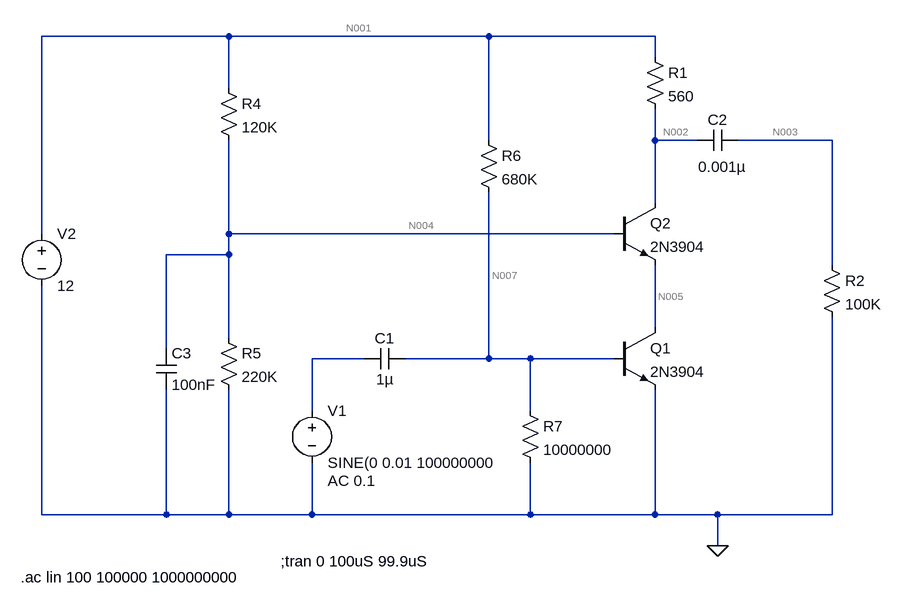
[diagram p0: schematic CascodeAmp2.asc]
CascodeAmp2.asc, the LTspice schematic file:
Version 4
SHEET 1 980 680
WIRE -416 -432 -704 -432
WIRE -16 -432 -416 -432
WIRE 240 -432 -16 -432
WIRE 240 -400 240 -432
WIRE -416 -352 -416 -432
WIRE -16 -272 -16 -432
WIRE 240 -272 240 -320
WIRE 304 -272 240 -272
WIRE 512 -272 368 -272
WIRE 240 -176 240 -272
WIRE -704 -128 -704 -432
WIRE -416 -128 -416 -272
WIRE 176 -128 -416 -128
WIRE -416 -96 -416 -128
WIRE -416 -96 -512 -96
WIRE 512 -80 512 -272
WIRE 240 16 240 -80
WIRE -416 32 -416 -96
WIRE -512 48 -512 -96
WIRE -208 64 -288 64
WIRE -16 64 -16 -192
WIRE -16 64 -144 64
WIRE 48 64 -16 64
WIRE 176 64 48 64
WIRE -288 144 -288 64
WIRE 48 144 48 64
WIRE -704 304 -704 -48
WIRE -512 304 -512 112
WIRE -512 304 -704 304
WIRE -416 304 -416 112
WIRE -416 304 -512 304
WIRE -288 304 -288 224
WIRE -288 304 -416 304
WIRE 48 304 48 224
WIRE 48 304 -288 304
WIRE 240 304 240 112
WIRE 240 304 48 304
WIRE 336 304 240 304
WIRE 512 304 512 0
WIRE 512 304 336 304
WIRE 336 352 336 304
FLAG 336 352 0
SYMBOL npn 176 16 R0
SYMATTR InstName Q1
SYMATTR Value 2N3904
SYMBOL cap -144 48 R90
WINDOW 0 0 32 VBottom 2
WINDOW 3 32 32 VTop 2
SYMATTR InstName C1
SYMATTR Value 1µ
SYMBOL res 224 -416 R0
SYMATTR InstName R1
SYMATTR Value 560
SYMBOL voltage -288 128 R0
WINDOW 123 24 124 Left 2
WINDOW 39 0 0 Left 0
SYMATTR Value2 AC 0.1
SYMATTR InstName V1
SYMATTR Value SINE(0 0.01 100000000
SYMBOL voltage -704 -144 R0
SYMATTR InstName V2
SYMATTR Value 12
SYMBOL cap 368 -288 R90
WINDOW 0 0 32 VBottom 2
WINDOW 3 41 25 VTop 2
SYMATTR InstName C2
SYMATTR Value 0.001µ
SYMBOL npn 176 -176 R0
SYMATTR InstName Q2
SYMATTR Value 2N3904
SYMBOL res -432 -368 R0
SYMATTR InstName R4
SYMATTR Value 120K
SYMBOL res -432 16 R0
SYMATTR InstName R5
SYMATTR Value 220K
SYMBOL res -32 -288 R0
SYMATTR InstName R6
SYMATTR Value 680K
SYMBOL res 32 128 R0
SYMATTR InstName R7
SYMATTR Value 10000000
SYMBOL cap -528 48 R0
SYMATTR InstName C3
SYMATTR Value 100nF
SYMBOL res 496 -96 R0
SYMATTR InstName R2
SYMATTR Value 100K
TEXT -336 376 Left 2 !;tran 0 100uS 99.9uS
TEXT -736 400 Left 2 !.ac lin 100 100000 1000000000

The netlist it stands for:
* CascodeAmp2.asc
Q1 N005 N007 0 0 2N3904
C1 N007 N006 1µ
R1 N001 N002 560
V1 N006 0 SINE(0 0.01 100000000 AC 0.1
V2 N001 0 12
C2 N003 N002 0.001µ
Q2 N002 N004 N005 0 2N3904
R4 N001 N004 120K
R5 N004 0 220K
R6 N001 N007 680K
R7 N007 0 10000000
C3 N004 0 100nF
R2 N003 0 100K
.model NPN NPN
.model PNP PNP
.lib standard.bjt
;tran 0 100uS 99.9uS
.ac lin 100 100000 1000000000
.backanno
.end

* Results of the author's LTspice run, read from the files saved beside the schematic
* Operating Point, zero values left out:
*   V(n005) = 5.756 V
*   V(n007) = 697.4 mV
*   V(n001) = 12 V
*   V(n002) = 9.124 V
*   V(n004) = 6.454 V
*   Ic(Q2) = 5.137 mA
*   Ib(Q2) = 16.89 µA
*   Ie(Q2) = -5.153 mA
*   Ic(Q1) = 5.153 mA
*   Ib(Q1) = 16.55 µA
*   Ie(Q1) = -5.17 mA
*   I(R7) = 69.74 nA
*   I(R6) = 16.62 µA
*   I(R5) = 29.33 µA
*   I(R4) = 46.22 µA
*   I(R1) = 5.137 mA
*   I(V2) = -5.199 mA
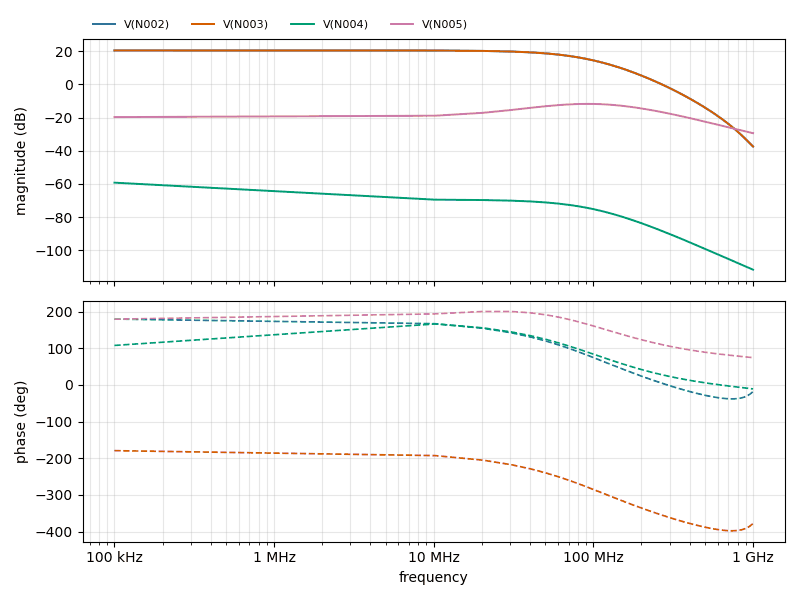
[diagram p1: AC Analysis of CascodeAmp2.asc, plotted from the saved traces]
* AC Analysis, 1 run:
*   V(N002): 20.49 dB at 100 kHz, -37.46 dB at 1 GHz, peak 20.49 dB at 100 kHz, 3 dB below the peak at 66.18 MHz
*   V(N003): 20.48 dB at 100 kHz, -37.46 dB at 1 GHz, peak 20.48 dB at 100 kHz, 3 dB below the peak at 66.19 MHz
*   V(N004): -59.27 dB at 100 kHz, -111.76 dB at 1 GHz, peak -59.27 dB at 100 kHz, 3 dB below the peak at 388.4 kHz
*   V(N005): -19.74 dB at 100 kHz, -29.44 dB at 1 GHz, peak -11.76 dB at 91 MHz, 3 dB below the peak at 35.28 MHz and 207.6 MHz